# EasyEDA schematic SCH_Syntheseproject_proof_of_concept_communicatie_2022-10-21.json
TITLE: Sheet_1; REV: 1.0; Date: 2022-10-14; Sheet: 1/1; Drawn By: roova; Company: Your Company
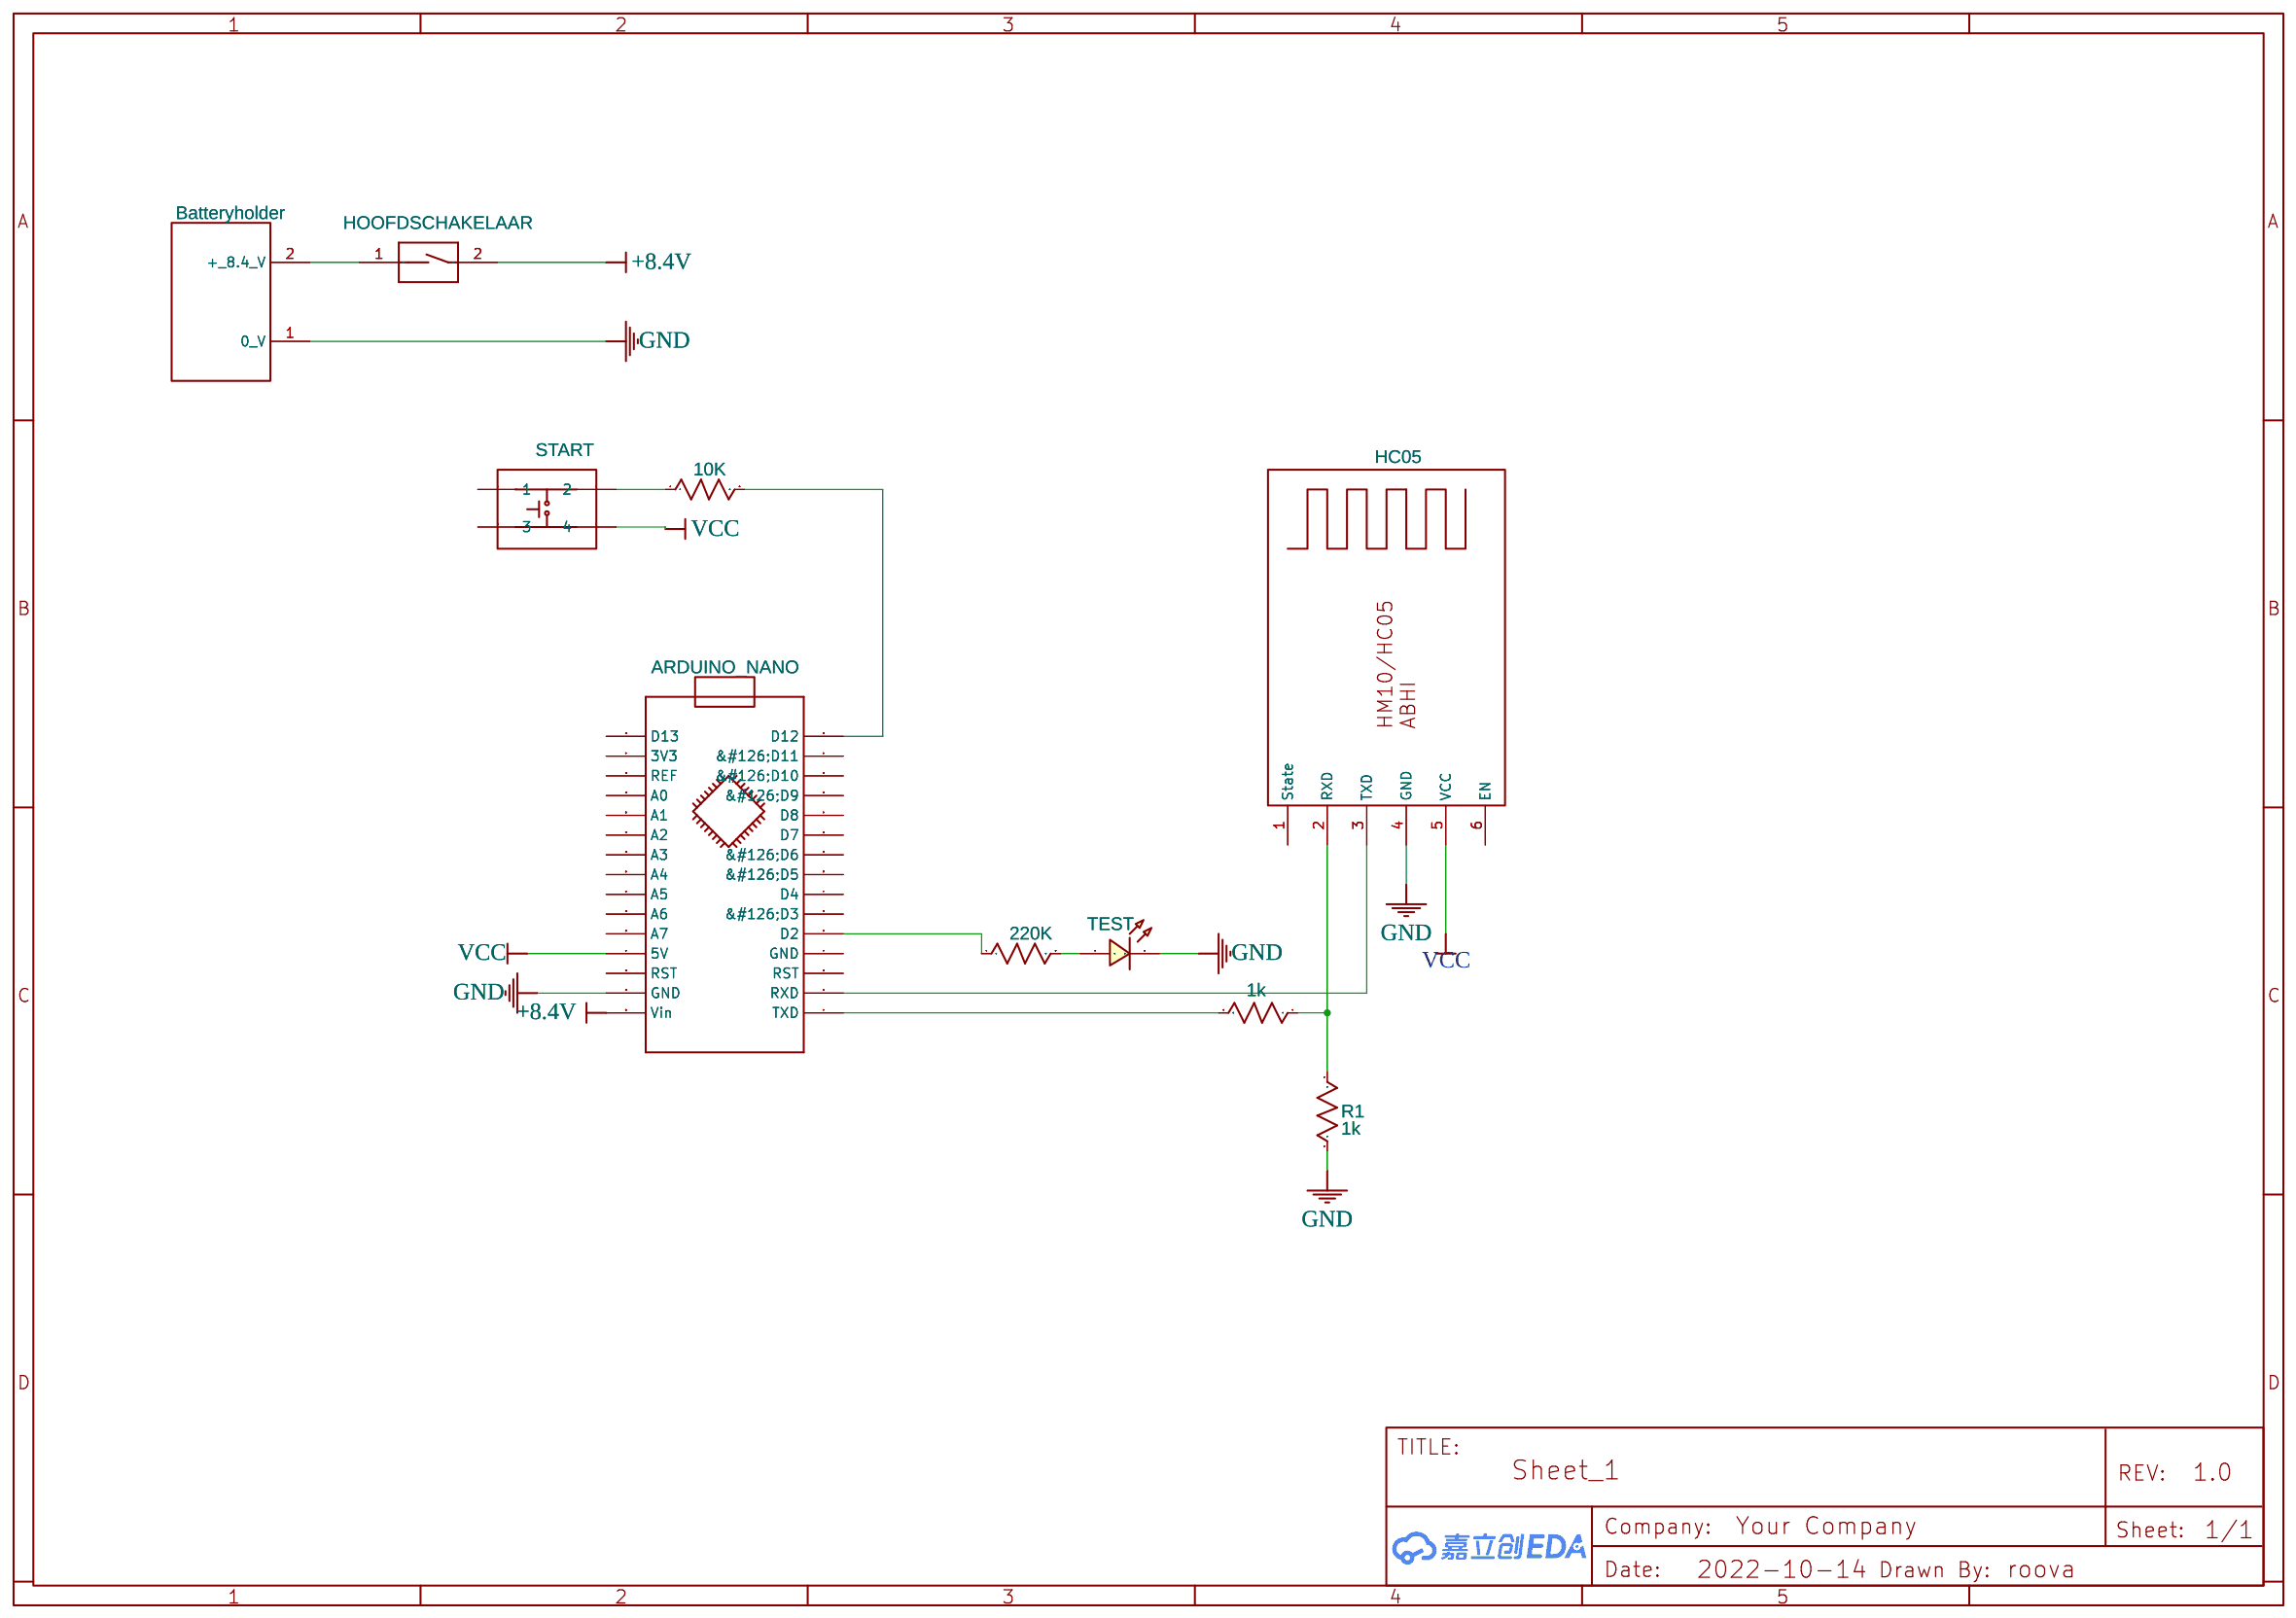
[diagram p0: schematic sheet]

## Parts
10K  1k  [R0603]
220K  1k  [R0603]
ARDUINO_NANO  ARDUINO-NANO_V3  [ARDUINO-NANO_AK]
HOOFDSCHAKELAAR  DIP1  [DIP SWITCH DIP1]
R1  1k  [R0603]
R2  1k  [R0603]
START  PUSHBUTTON 6X6X4.5 4 PINS COPY  [PUSH_BUTTON_4_PIN]
TEST  LED-0603_R  [LED0603_RED]
U3  HC05  [HM-10/HC-05-PCB-ABHI]
U4  Batteryholder  [BATTERYHOLDER_FP]

## Library data of the parts
10K 220K R1 R2 = R_0603_US: Contributor: LCEDA_Lib
ARDUINO_NANO = ARDUINO-NANO_V3: Contributor: madhunm
HOOFDSCHAKELAAR = DIP1: Supplier: Digi-Key; Manufacturer: Omron Electronics Inc-EMC Div; Manufacturer Part: A6TN-1101; Supplier Part: Z12167-ND
START = PUSHBUTTON 6X6X4.5 4 PINS COPY: Manufacturer: sparkfun; Manufacturer Part: sparkfun; Contributor: Jesus Rosales
TEST = LED-0603_R: Manufacturer: EVERLIGHT(台湾亿光); Manufacturer Part: 19-217/R6C-AL1M2VY/3T; Supplier Part: C72044; Supplier: LCSC; Contributor: LCEDA_01
U3 = HC05/HM10-Abhi: Contributor: undefined.abhinav19
U4 = Batteryholder: Contributor: Foxl84

## Nets
+8.4V: ARDUINO_NANO.30(Vin) HOOFDSCHAKELAAR.2
GND: ARDUINO_NANO.29(GND) R1.1 TEST.2 U3.4(GND) U4.1(0 V)
VCC: ARDUINO_NANO.27(5V) START.4 U3.5(VCC)
Net-(10K-1): 10K.1 START.2
Net-(10K-2): 10K.2 ARDUINO_NANO.15(D12)
Net-(220K-1): 220K.1 ARDUINO_NANO.5(D2)
Net-(220K-2): 220K.2 TEST.1
Net-(ARDUINO_NANO-1): ARDUINO_NANO.1(TXD) R2.2
Net-(ARDUINO_NANO-2): ARDUINO_NANO.2(RXD) U3.3(TXD)
Net-(HOOFDSCHAKELAAR-1): HOOFDSCHAKELAAR.1 U4.2(+ 8.4 V)
Net-(R1-2): R1.2 R2.1 U3.2(RXD)

Not connected (* = marked no-connect by the designer): ARDUINO_NANO 3(RST) 4(GND) 6(&#126;D3) 7(D4) 8(&#126;D5) 9(&#126;D6) 10(D7) 11(D8) 12(&#126;D9) 13(&#126;D10) 14(&#126;D11) 16(D13) 17(3V3) 18(REF) 19(A0) 20(A1) 21(A2) 22(A3) 23(A4) 24(A5) 25(A6) 26(A7) 28(RST); START 1 3; U3 1(State) 6(EN)
